# EAGLE design PotentialGainSensor (EAGLE 7.4.0)
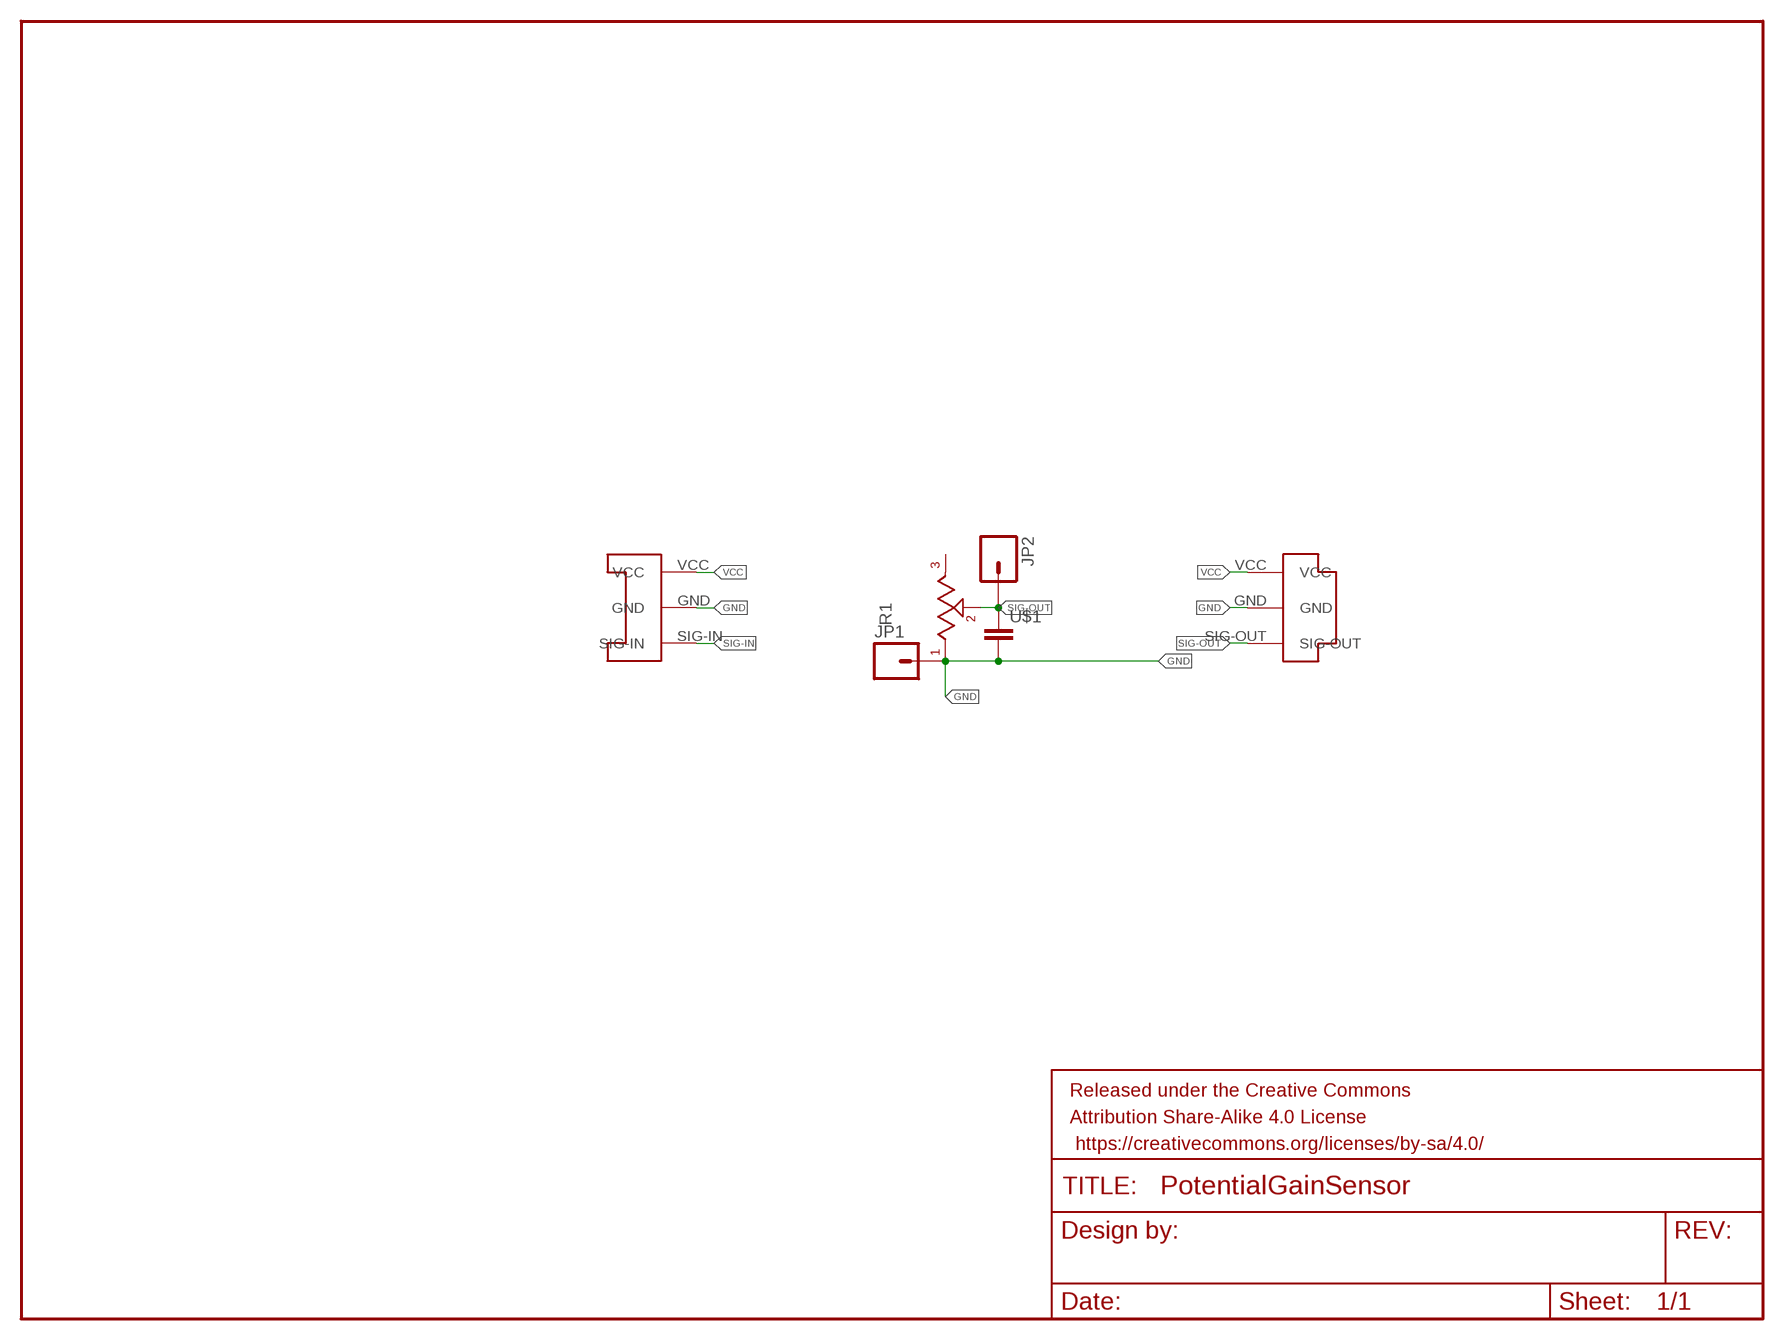
[diagram p0: schematic, sheet 1]

## Parts
FRAME1  FRAME-LETTERNO_PACKAGE  [DUMMY]
JP1  M01SPRING-CONN  [SPRING-CONNECTOR]
JP2  M01SPRING-CONN  [SPRING-CONNECTOR]
R1  POT-TRIM-SMD-BOURNS-3314J-1  [POT-TRIM-SMD-BOURNS-3314]
U$1  CAPCAP-0805  [CAP-0805]
U$2  CONN-PLUG-3POS-3MM  [PLUG-3POS-3MM-SMD]
U$3  CONN-SOCKET-3POS-3MM  [SOCKET-3POS-3MM-SMD]

## Nets
GND: JP1.P$2 R1.3 U$1.2 U$2.GND U$3.GND
SIG-IN: U$3.SIG-IN
SIG-OUT: JP2.P$2 R1.2 U$1.1 U$2.SIG-OUT
VCC: U$2.VCC U$3.VCC
Unconnected: R1.1

## Library data of the parts
FRAME1 = SparkFun-Aesthetics:FRAME-LETTER: Schematic Frame Standard 8.5x11 US Letter frame; DESIGNER: Nobody; VERSION: v01
JP1 JP2 = SparkFun-Connectors:M01: Header 1 Standard 1-pin 0.1" header. Use with straight break away headers (SKU : PRT-00116), right angle break away headers (PRT-00553), swiss pins (PRT-00743), machine pins (PRT-00117), and female headers (PRT-00115). SMTSO-256-ET is a "flush mount" nut for a 4-40 screw. The older package used to be too tight, and did not allow it to sit properly thru the drill hit. The latest (0.165DIA) fits nice and snug.
R1 = LITTLEBITS140915:POT-TRIM-SMD-BOURNS-3314: Bourns 3314 - 4mm Square Trimming Potentiometer
U$1 = LITTLEBITS140915:CAP
U$2 = EmbeddedPlayground:CONN-PLUG-3POS-3MM: Surface mount board to board connector. Female socket, 3 position.
U$3 = EmbeddedPlayground:CONN-SOCKET-3POS-3MM: Surface mount board to board connector. Female socket, 3 position.

## Board
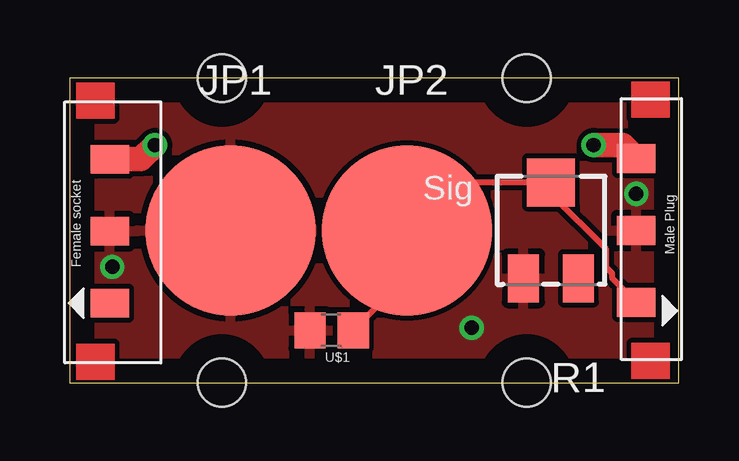
[diagram p1: board, top side]
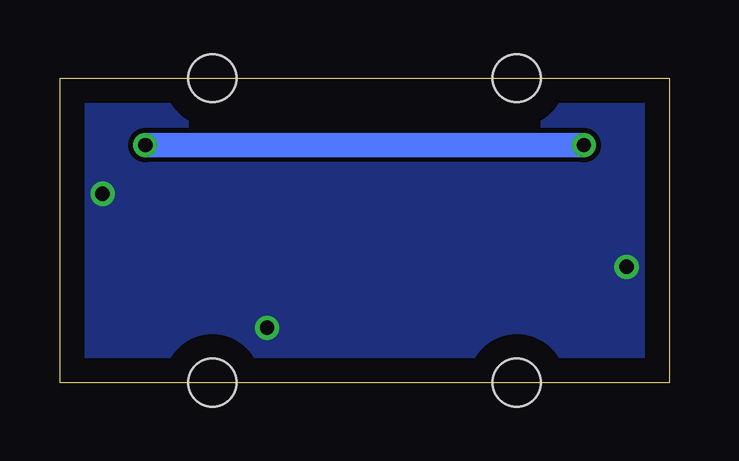
[diagram p2: board, bottom side, seen from below]

Size 25.4 x 12.7 mm. Coordinates in mm from the lower left corner, seen from the top.
Outline: 0,0 25.4,0 25.4,12.7 0,12.7 0,0
Copper layers (1*16): Top 0.035mm / dielectric 1.5mm / Bottom 0.035mm
Design rules "default": minimum track width 10mil, minimum drill 24mil, track to track 8mil, track to pad 8mil, pad to pad 8mil, via to via 8mil, smd to smd 8mil, copper to edge 40mil, drill to drill 8mil, minimum pad ring 10mil, minimum via ring 8mil, stop-mask expansion 4mil, vias tented up to drill 0mil, thermal gap 10mil
Holes 2 mm at 6.35,0 6.35,12.7 19.05,12.7 19.05,0

### Footprints (pad centres in the part's own frame; a part is rotated, then mirrored left to right if it is on the bottom)
SPRING-CONNECTOR = smd 7.112 x 7.112: P$2 0,0
POT-TRIM-SMD-BOURNS-3314 = smd 1.3 x 2: 1 -1.15,2; 3 1.15,2 | smd 2 x 2: 2 0,-2
CAP-0805 = smd 1.3 x 1.5: 1 -0.9,0; 2 0.9,0
PLUG-3POS-3MM-SMD = smd 1.2 x 1.6: GND 0,0; SIG-OUT 3,0; VCC -3,0
SOCKET-3POS-3MM-SMD = smd 1.2 x 1.6: GND 0,0; SIG-IN -3,0; VCC 3,0

### Placement (x,y rotation side)
FRAME1  0,0 0 top
JP1  6.7,6.35 0 top
JP2  14.07,6.35 0 top
R1  20.07,6.35 180 top
U$1  10.92,2.19 180 top
U$2  23.62,6.35 270 top
U$3  1.67,6.32 90 top

### Tracks (layer width: path | path; a pad name or v marks a point on that pad's centre or on a via)
GND  (via drill 0.6)
  other vias: 1.78,4.83 23.62,7.87 16.76,2.29
  pour Bottom: -1.27,13.97 31.75,13.97 31.75,-1.27 -1.27,-1.27
  pour Top: -1.27,13.97 -1.27,-1.27 31.75,-1.27 31.75,13.97
N$2  (via drill 0.6)
  other vias: 3.56,9.91
N$4  (via drill 0.6)
  other vias: 21.84,9.91
SIG-OUT
  Top 0.254: 23.35,3.35 U$2.SIG-OUT 22.61,4.37 22.61,4.57 22.35,4.83 22.35,5.59 20.07,7.87 R1.2 16.07,8.35 JP2.P$2 14.07,4.43 U$1.1
VCC  (via drill 0.6)
  Top 1.016: U$3.VCC 2.97,9.32 v3.56,9.91 | v21.84,9.91 23.07,9.91 U$2.VCC
  Bottom 1.016: v3.56,9.91 v21.84,9.91

### Text on the board
tSilk: Sig